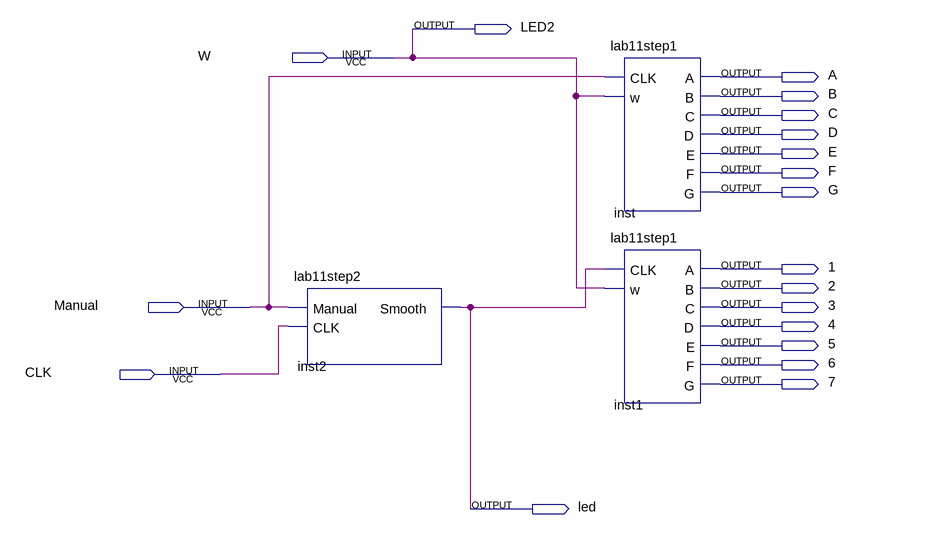
[diagram p0: schematic sheet]
// Quartus schematic lab11step3.bdf as structural Verilog: 3 symbols, 19 pins
module lab11step3 (
  input  W,
  input  Manual,
  input  CLK,
  output LED2,
  output A,
  output B,
  output C,
  output D,
  output E,
  output F,
  output G,
  output \1 ,
  output \2 ,
  output \3 ,
  output \4 ,
  output \5 ,
  output \6 ,
  output \7 ,
  output led
);

  lab11step2 inst2 (.Manual(Manual), .CLK(CLK), .Smooth(led));
  lab11step1 inst (.CLK(Manual), .w(W), .A(A), .B(B), .C(C), .D(D), .E(E), .F(F), .G(G));
  lab11step1 inst1 (.CLK(led), .w(W), .A(\1 ), .B(\2 ), .C(\3 ), .D(\4 ), .E(\5 ), .F(\6 ), .G(\7 ));

  assign LED2 = W;
endmodule
